# Altium schematic sheet 8-connector.SchDoc
size A4
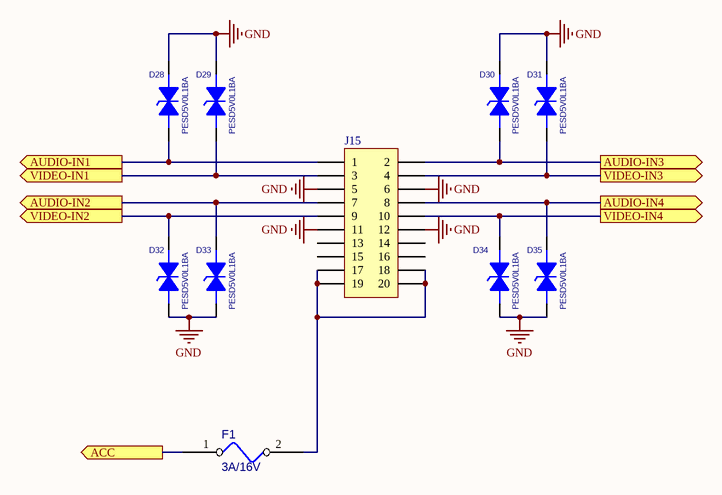
[diagram p0: 8-connector.SchDoc]

## Parts
D28  PESD5V0L1BA  [SOD323]
D29  PESD5V0L1BA  [SOD323]
D30  PESD5V0L1BA  [SOD323]
D31  PESD5V0L1BA  [SOD323]
D32  PESD5V0L1BA  [SOD323]
D33  PESD5V0L1BA  [SOD323]
D34  PESD5V0L1BA  [SOD323]
D35  PESD5V0L1BA  [SOD323]
F1  3A/16V  [2920]
J15  Header 10X2  [CONN2X10]  (value not drawn)

## Ports
ACC (out), AUDIO-IN1 (out), AUDIO-IN2 (out), AUDIO-IN3 (out), AUDIO-IN4 (out), VIDEO-IN1 (out), VIDEO-IN2 (out), VIDEO-IN3 (out), VIDEO-IN4 (out)

## Nets
GND: D28.2 D29.2 D30.2 D31.2 D32.1 D33.1 D34.1 D35.1 J15.5 J15.6 J15.11 J15.12
ACC: F1.1 ; port ACC
AUDIO-IN1: D28.1 J15.1 ; port AUDIO-IN1
AUDIO-IN2: D33.2 J15.7 ; port AUDIO-IN2
AUDIO-IN3: D30.1 J15.2 ; port AUDIO-IN3
AUDIO-IN4: D35.2 J15.8 ; port AUDIO-IN4
VIDEO-IN1: D29.1 J15.3 ; port VIDEO-IN1
VIDEO-IN2: D32.2 J15.9 ; port VIDEO-IN2
VIDEO-IN3: D31.1 J15.4 ; port VIDEO-IN3
VIDEO-IN4: D34.2 J15.10 ; port VIDEO-IN4
NetF1_2: F1.2 J15.17 J15.18 J15.19 J15.20

Not connected (* = marked no-connect by the designer): J15 13 14 15 16

## Library data of the parts
D28-D35 = PESD
F1 = 2A_32VDC_0467-002
J15 = Header 10X2: Header, 10-Pin, Dual row; LatestRevisionDate: 17-Jul-2002; LatestRevisionNote: Re-released for DXP Platform.; Publisher: Altium Limited